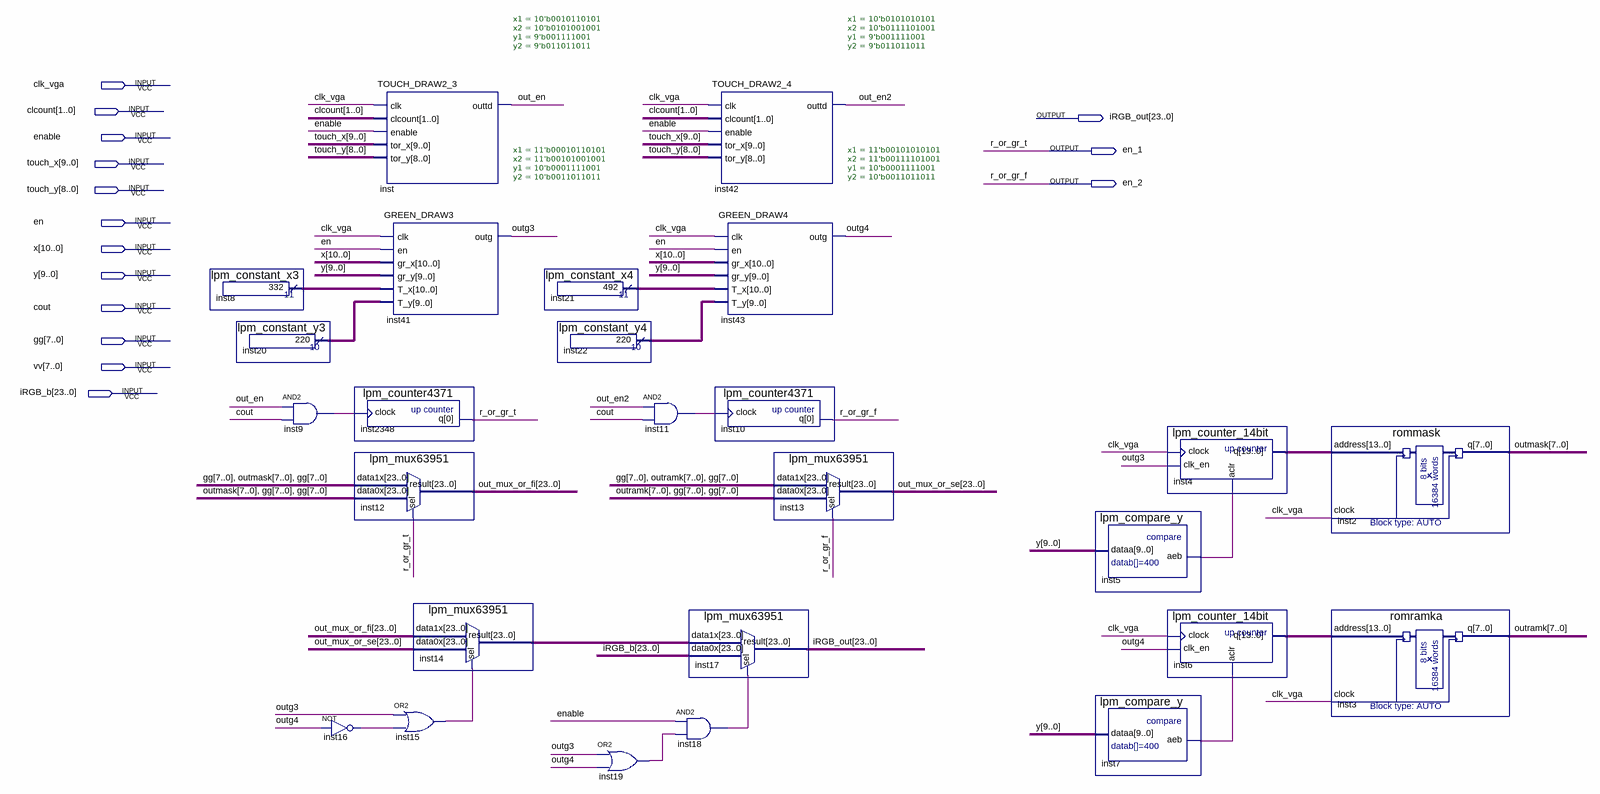
[diagram p0: schematic sheet]
// Quartus schematic Invisible_keys.bdf as structural Verilog: 26 symbols, 15 pins
module Invisible_keys (
  input  clk_vga,
  input  [1:0] clcount,
  input  enable,
  input  [9:0] touch_x,
  input  [8:0] touch_y,
  input  en,
  input  [10:0] x,
  input  [9:0] y,
  input  cout,
  input  [7:0] gg,
  input  [7:0] vv,
  input  [23:0] iRGB_b,
  output [23:0] iRGB_out,
  output en_1,
  output en_2
);

  wire inst5_aeb, inst7_aeb, inst9_out, inst11_out, inst15_out, inst16_out, inst18_out, inst19_out, out_en,
       out_en2, outg3, outg4;
  wire [7:0] outmask, outramk;
  wire [9:0] inst20_result, inst22_result;
  wire [10:0] inst8_result, inst21_result;
  wire [13:0] inst4_q, inst6_q;
  wire [23:0] inst14_result, out_mux_or_fi, out_mux_or_se;

  lpm_constant_x3 inst8 (.result(inst8_result));
  lpm_constant_y3 inst20 (.result(inst20_result));
  and inst9 (inst9_out, out_en, cout);
  not inst16 (inst16_out, outg4);
  TOUCH_DRAW2_3 #(.x1(10'b0010110101), .x2(10'b0101001001), .y1(9'b001111001), .y2(9'b011011011)) inst (
    .clk(clk_vga), .clcount(clcount), .enable(enable), .tor_x(touch_x), .tor_y(touch_y), .outtd(out_en));
  GREEN_DRAW3 #(.x1(11'b00010110101), .x2(11'b00101001001), .y1(10'b0001111001), .y2(10'b0011011011)) inst41 (
    .clk(clk_vga), .en(en), .gr_x(x), .gr_y(y), .T_x(inst8_result), .T_y(inst20_result), .outg(outg3));
  lpm_counter4371 inst2348 (.clock(inst9_out), .q(en_1));
  lpm_mux63951 inst12 (.data1x({gg, outmask, gg}), .data0x({outmask, gg, gg}), .sel(en_1), .result(out_mux_or_fi));
  lpm_mux63951 inst14 (.data1x(out_mux_or_fi), .data0x(out_mux_or_se), .sel(inst15_out), .result(inst14_result));
  or inst15 (inst15_out, outg3, inst16_out);
  lpm_constant_x4 inst21 (.result(inst21_result));
  lpm_constant_y4 inst22 (.result(inst22_result));
  and inst11 (inst11_out, out_en2, cout);
  or inst19 (inst19_out, outg3, outg4);
  lpm_mux63951 inst17 (.data1x(inst14_result), .data0x(iRGB_b), .sel(inst18_out), .result(iRGB_out));
  and inst18 (inst18_out, enable, inst19_out);
  TOUCH_DRAW2_4 #(.x1(10'b0101010101), .x2(10'b0111101001), .y1(9'b001111001), .y2(9'b011011011)) inst42 (
    .clk(clk_vga), .clcount(clcount), .enable(enable), .tor_x(touch_x), .tor_y(touch_y), .outtd(out_en2));
  GREEN_DRAW4 #(.x1(11'b00101010101), .x2(11'b00111101001), .y1(10'b0001111001), .y2(10'b0011011011)) inst43 (
    .clk(clk_vga), .en(en), .gr_x(x), .gr_y(y), .T_x(inst21_result), .T_y(inst22_result), .outg(outg4));
  lpm_counter4371 inst10 (.clock(inst11_out), .q(en_2));
  lpm_mux63951 inst13 (.data1x({gg, outramk, gg}), .data0x({outramk, gg, gg}), .sel(en_2), .result(out_mux_or_se));
  lpm_compare_y inst5 (.dataa(y), .aeb(inst5_aeb));
  lpm_compare_y inst7 (.dataa(y), .aeb(inst7_aeb));
  lpm_counter_14bit inst4 (.clock(clk_vga), .clk_en(outg3), .aclr(inst5_aeb), .q(inst4_q));
  lpm_counter_14bit inst6 (.clock(clk_vga), .clk_en(outg4), .aclr(inst7_aeb), .q(inst6_q));
  rommask inst2 (.address(inst4_q), .clock(clk_vga), .q(outmask));
  romramka inst3 (.address(inst6_q), .clock(clk_vga), .q(outramk));

  // Other names for the same wires on the sheet: r_or_gr_f = en_2; r_or_gr_t = en_1
endmodule
